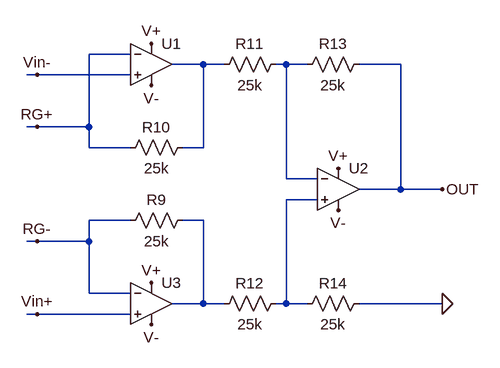
[diagram p0: schematic INA114.asc]
INA114.asc, the LTspice schematic file:
Version 4.1
SHEET 1 1276 1060
WIRE -752 176 -816 176
WIRE -640 192 -688 192
WIRE -608 192 -640 192
WIRE -512 192 -528 192
WIRE -480 192 -512 192
WIRE -336 192 -400 192
WIRE -896 208 -912 208
WIRE -752 208 -896 208
WIRE -896 288 -912 288
WIRE -816 288 -816 176
WIRE -816 288 -896 288
WIRE -816 320 -816 288
WIRE -752 320 -816 320
WIRE -640 320 -640 192
WIRE -640 320 -672 320
WIRE -512 368 -512 192
WIRE -464 368 -512 368
WIRE -336 384 -336 192
WIRE -336 384 -400 384
WIRE -272 384 -336 384
WIRE -464 400 -512 400
WIRE -752 432 -816 432
WIRE -640 432 -672 432
WIRE -896 464 -912 464
WIRE -816 464 -816 432
WIRE -816 464 -896 464
WIRE -816 544 -816 464
WIRE -752 544 -816 544
WIRE -640 560 -640 432
WIRE -640 560 -688 560
WIRE -608 560 -640 560
WIRE -512 560 -512 400
WIRE -512 560 -528 560
WIRE -480 560 -512 560
WIRE -272 560 -400 560
WIRE -896 576 -912 576
WIRE -752 576 -896 576
FLAG -896 576 Vin+
FLAG -896 208 Vin-
FLAG -272 384 OUT
FLAG -272 560 0
FLAG -896 288 RG+
FLAG -896 464 RG-
FLAG -432 352 V+
FLAG -720 160 V+
FLAG -720 528 V+
FLAG -432 416 V-
FLAG -720 224 V-
FLAG -720 592 V-
SYMBOL res -656 416 R90
WINDOW 0 0 56 VBottom 2
WINDOW 3 32 56 VTop 2
SYMATTR InstName R9
SYMATTR Value 25k
SYMATTR SpiceLine tol=1 pwr=0.1
SYMBOL res -656 304 R90
WINDOW 0 0 56 VBottom 2
WINDOW 3 32 56 VTop 2
SYMATTR InstName R10
SYMATTR Value 25k
SYMATTR SpiceLine tol=1 pwr=0.1
SYMBOL res -512 176 R90
WINDOW 0 0 56 VBottom 2
WINDOW 3 32 56 VTop 2
SYMATTR InstName R11
SYMATTR Value 25k
SYMATTR SpiceLine tol=1 pwr=0.1
SYMBOL res -512 544 R90
WINDOW 0 0 56 VBottom 2
WINDOW 3 32 56 VTop 2
SYMATTR InstName R12
SYMATTR Value 25k
SYMATTR SpiceLine tol=1 pwr=0.1
SYMBOL res -384 176 R90
WINDOW 0 0 56 VBottom 2
WINDOW 3 32 56 VTop 2
SYMATTR InstName R13
SYMATTR Value 25k
SYMATTR SpiceLine tol=1 pwr=0.1
SYMBOL res -384 544 R90
WINDOW 0 0 56 VBottom 2
WINDOW 3 32 56 VTop 2
SYMATTR InstName R14
SYMATTR Value 25k
SYMATTR SpiceLine tol=1 pwr=0.1
SYMBOL OpAmps\\UniversalOpAmp -720 192 R0
SYMATTR InstName U1
SYMBOL OpAmps\\UniversalOpAmp -432 384 R0
SYMATTR InstName U2
SYMBOL OpAmps\\UniversalOpAmp -720 560 R0
SYMATTR InstName U3

The netlist it stands for:
* INA114.asc
R9 N004 RG- 25k tol=1 pwr=0.1
R10 N001 RG+ 25k tol=1 pwr=0.1
R11 N002 N001 25k tol=1 pwr=0.1
R12 N003 N004 25k tol=1 pwr=0.1
R13 OUT N002 25k tol=1 pwr=0.1
R14 0 N003 25k tol=1 pwr=0.1
X§U1 Vin- RG+ V+ V- N001 level1 Avol=1Meg GBW=10Meg Vos=0 En=0 Enk=0 In=0 Ink=0 Rin=500Meg  ; pins In+ In- V+ V- OUT
X§U2 N003 N002 V+ V- OUT level1 Avol=1Meg GBW=10Meg Vos=0 En=0 Enk=0 In=0 Ink=0 Rin=500Meg  ; pins In+ In- V+ V- OUT
X§U3 Vin+ RG- V+ V- N004 level1 Avol=1Meg GBW=10Meg Vos=0 En=0 Enk=0 In=0 Ink=0 Rin=500Meg  ; pins In+ In- V+ V- OUT
.lib UniversalOpAmp1.lib
.backanno
.end